# EAGLE design main (EAGLE 6.4)
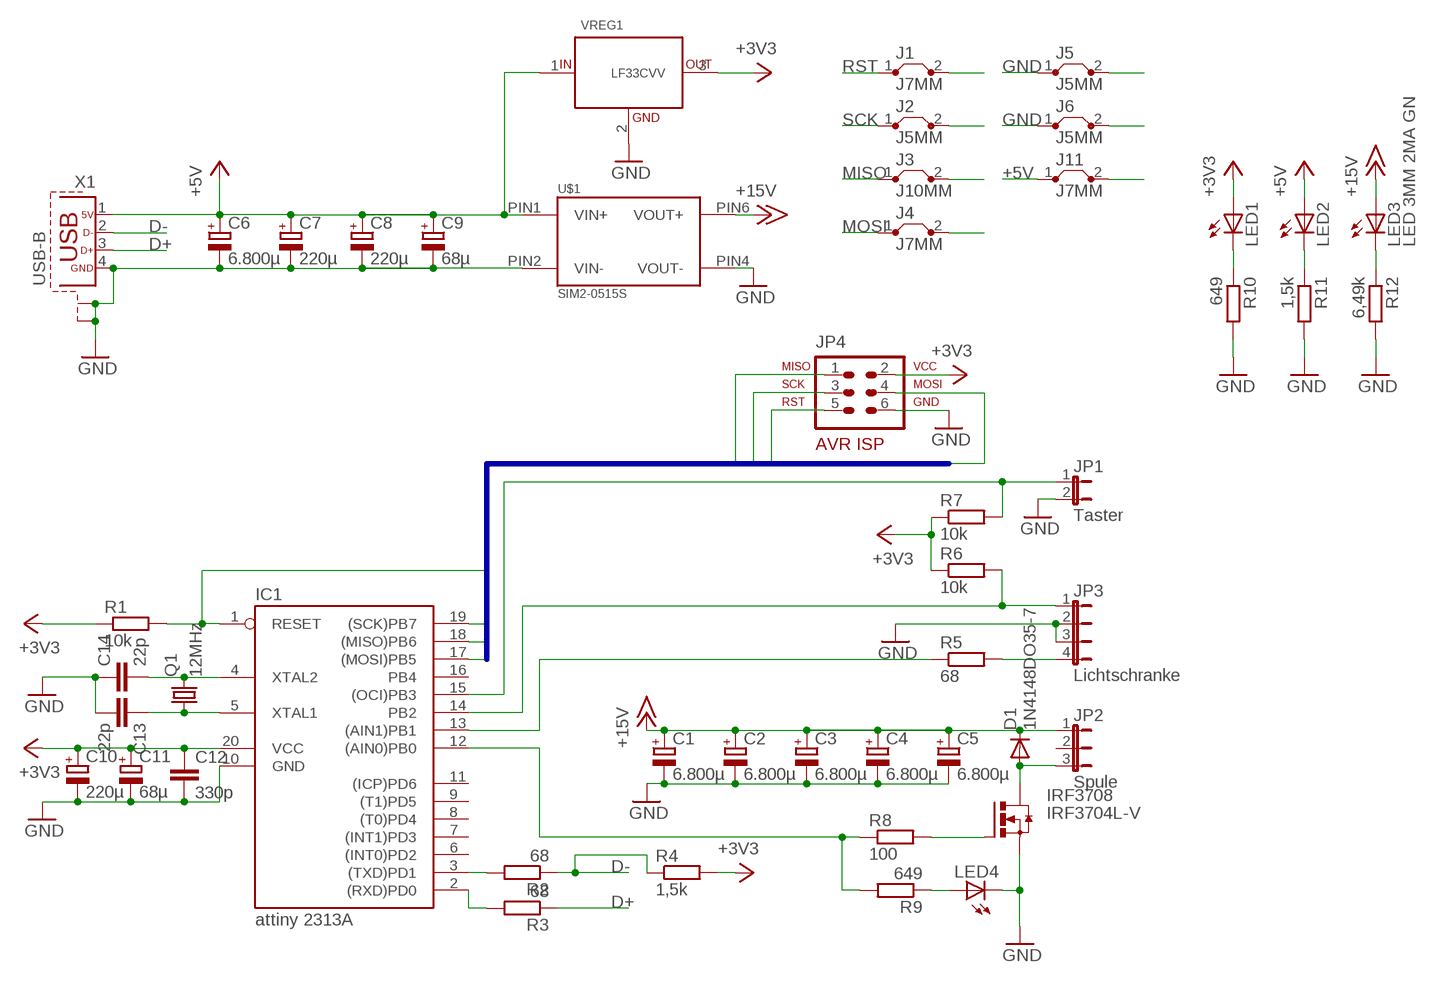
[diagram p0: schematic, sheet 1]

## Parts
C1  6.800µ  CPOL-EUE7.5-18  [E7,5-18]
C2  6.800µ  CPOL-EUE7.5-18  [E7,5-18]
C3  6.800µ  CPOL-EUE7.5-18  [E7,5-18]
C4  6.800µ  CPOL-EUE7.5-18  [E7,5-18]
C5  6.800µ  CPOL-EUE7.5-18  [E7,5-18]
C6  6.800µ  CPOL-EUE7.5-18  [E7,5-18]
C7  220µ  CPOL-EUE2.5-7  [E2,5-7]
C8  220µ  CPOL-EUE2.5-7  [E2,5-7]
C9  68µ  CPOL-EUE2.5-7  [E2,5-7]
C10  220µ  CPOL-EUE2.5-7  [E2,5-7]
C11  68µ  CPOL-EUE2.5-7  [E2,5-7]
C12  330p  C-EU050-024X044  [C050-024X044]
C13  22p  C-EU050-024X044  [C050-024X044]
C14  22p  C-EU050-024X044  [C050-024X044]
D1  1N4148DO35-7  [DO35-7]
IC1  attiny 2313A  AT90S2313P  [DIL20]
IRF3708  IRF3704L-V  [TO262-V]
J1  J7MM  [07]
J2  J5MM  [05]
J3  J10MM  [10]
J4  J7MM  [07]
J5  J5MM  [05]
J6  J5MM  [05]
J11  J7MM  [07]
JP1  Taster  JP1E  [JP1]
JP2  Spule  JP2E  [JP2]
JP3  Lichtschranke  JP4E  [JP4]
JP4  AVR-ISP-6VERT  [AVR-ISP-6]
LED1  LED3MM  [LED3MM]
LED2  LED3MM  [LED3MM]
LED3  LED 3MM 2MA GN  LED3MM  [LED3MM]
LED4  LED3MM  [LED3MM]
Q1  12MHz  CRYSTALHC18U-V  [HC18U-V]
R1  10k  R-EU_0207/10  [0207/10]
R2  68  R-EU_0207/10  [0207/10]
R3  68  R-EU_0207/10  [0207/10]
R4  1,5k  R-EU_0207/10  [0207/10]
R5  68  R-EU_0207/10  [0207/10]
R6  10k  R-EU_0207/10  [0207/10]
R7  10k  R-EU_0207/10  [0207/10]
R8  100  R-EU_0207/10  [0207/10]
R9  649  R-EU_0207/10  [0207/10]
R10  649  R-EU_0207/7  [0207/7]
R11  1,5k  R-EU_0207/7  [0207/7]
R12  6,49k  R-EU_0207/10  [0207/10]
U$1  SIM2-0515S  [SIL7]
VREG1  LF33CVV  [TO220V]
X1  USB-B  [USB-B]

## Nets
+3V3: C10.+ C11.+ C12.1 IC1.20(VCC) JP4.2 LED1.A R1.1 R4.2 R6.1 R7.1 VREG1.3(OUT)
+5V: C6.+ C7.+ C8.+ C9.+ J11.1 J11.2 LED2.A U$1.PIN1(VIN+) VREG1.1(IN) X1.1
+15V: C1.+ C2.+ C3.+ C4.+ C5.+ D1.C JP2.1 LED3.A U$1.PIN6(VOUT+)
D+: R3.1 X1.3
D-: R2.1 R4.1 X1.2
GND: C1.- C2.- C3.- C4.- C5.- C6.- C7.- C8.- C9.- C10.- C11.- C12.2 C13.2 C14.1 IC1.10(GND) IRF3708.3(S) J5.1 J5.2 J6.1 J6.2 JP1.2 JP3.2 JP3.3 JP4.6 LED4.K(C) R10.2 R11.2 R12.2 U$1.PIN2(VIN-) U$1.PIN4(VOUT-) VREG1.2(GND) X1.4 X1.S1 X1.S2
MISO: IC1.18((MISO)PB6) J3.1 J3.2 JP4.1
MOSI: IC1.17((MOSI)PB5) J4.1 J4.2 JP4.4
N$1: LED3.K(C) R12.1
N$2: IRF3708.1(G) R8.2
N$3: D1.A IRF3708.2(D) JP2.3
N$4: LED2.K(C) R11.1
N$5: LED1.K(C) R10.1
N$7: LED4.A R9.1
N$8: JP3.4 R5.2
N$11: C13.1 IC1.5(XTAL1) Q1.1
N$12: C14.2 IC1.4(XTAL2) Q1.2
N$13: IC1.15((OCI)PB3) JP1.1 R7.2
N$14: IC1.13((AIN1)PB1) R5.1
N$15: IC1.14(PB2) JP3.1 R6.2
N$18: IC1.2((RXD)PD0) R3.2
N$19: IC1.3((TXD)PD1) R2.2
PB0: IC1.12((AIN0)PB0) R8.1 R9.2
RST: IC1.1(RESET) J1.1 J1.2 JP4.5 R1.2
SCK: IC1.19((SCK)PB7) J2.1 J2.2 JP4.3
Unconnected: IC1.6((INT0)PD2) IC1.7((INT1)PD3) IC1.8((T0)PD4) IC1.9((T1)PD5) IC1.11((ICP)PD6) IC1.16(PB4) JP2.2

## Buses
MISO,MOSI,RST,SCK

## Library data of the parts
C1-C11 = resistor:CPOL-EU: POLARIZED CAPACITOR, European symbol
C12-C14 = rcl:C-EU: CAPACITOR, European symbol
D1 = diode:1N4148: DIODE high speed (Philips)
IC1 = atmel:AT90S2313: MICROCONTROLLER 2 Kbytes FLASH 128 bytes SRAM 128 bytes EEPROM UART; OC_FARNELL: unknown; OC_NEWARK: unknown
IRF3708 = transistor-power:IRF3704: SMPS MOSFET HEXFET® Power MOSFET Source: http://www.irf.com/product-info/datasheets/data/irf3704.pdf
J1-J6 J11 = jumper:J: Bridge
JP1 = jumper:JP1E: JUMPER
JP2 = jumper:JP2E: JUMPER
JP3 = jumper:JP4E: JUMPER
JP4 = avr-7:AVR-ISP-6: AVR ISP-6 Serial Programming Header
LED1-LED4 = led:LED: LED OSRAM: - CHIPLED LG R971, LG N971, LY N971, LG Q971, LY Q971, LO R971, LY R971 LH N974, LH R974 LS Q976, LO Q976, LY Q976 LO Q996 - Hyper CHIPLED LW Q18S LB Q993, LB Q99A, LB R99A - SideLED LS A670, LO A670, LY A670, LG A670, LP A670 LB A673, LV A673, LT A673, LW A673 LH A674 LY A675 LS A676, LA A676, LO A676, LY A676, LW A676 LS A679, LY A679, LG A679 - Hyper Micro SIDELED® LS Y876, LA Y876, LO Y876, LY Y876 LT Y87S - SmartLED LW L88C, LW L88S LB L89C, LB L89S, LG L890 LS L89K, LO L89K, LY L89K LS L896, LA L896, LO L896, LY L896 - TOPLED LS T670, LO T670, LY T670, LG T670, LP T670 LSG T670, LSP T670, LSY T670, LOP T670, LYG T670 LG T671, LOG T671, LSG T671 LB T673, LV T673, LT T673, LW T673 LH T674 LS T676, LA T676, LO T676, LY T676, LB T676, LH T676, LSB T676, LW T676 LB T67C, LV T67C, LT T67C, LS T67K, LO T67K, LY T67K, LW E67C LS E67B, LA E67B, LO E67B, LY E67B, LB E67C, LV E67C, LT E67C LW T67C LS T679, LY T679, LG T679 LS T770, LO T770, LY T770, LG T770, LP T770 LB T773, LV T773, LT T773, LW T773 LH T774 LS E675, LA E675, LY E675, LS T675 LS T776, LA T776, LO T776, LY T776, LB T776 LHGB T686 LT T68C, LB T68C - Hyper Mini TOPLED® LB M676 - Mini TOPLED Santana® LG M470 LS M47K, LO M47K, LY M47K Source: http://www.osram.convergy.de LUXEON: - LUMILED® LXK2-PW12-R00, LXK2-PW12-S00, LXK2-PW14-U00, LXK2-PW14-V00 LXK2-PM12-R00, LXK2-PM12-S00, LXK2-PM14-U00 LXK2-PE12-Q00, LXK2-PE12-R00, LXK2-PE12-S00, LXK2-PE14-T00, LXK2-PE14-U00 LXK2-PB12-K00, LXK2-PB12-L00, LXK2-PB12-M00, LXK2-PB14-N00, LXK2-PB14-P00, LXK2-PB14-Q00 LXK2-PR12-L00, LXK2-PR12-M00, LXK2-PR14-Q00, LXK2-PR14-R00 LXK2-PD12-Q00, LXK2-PD12-R00, LXK2-PD12-S00 LXK2-PH12-R00, LXK2-PH12-S00 LXK2-PL12-P00, LXK2-PL12-Q00, LXK2-PL12-R00 Source: www.luxeon.com KINGBRIGHT: KA-3528ASYC Source: www.kingbright.com
Q1 = crystal:CRYSTAL: CRYSTAL; OC_FARNELL: unknown; OC_NEWARK: unknown
R1-R12 = rcl:R-EU_: RESISTOR, European symbol
U$1 = eigene:SIM2-0515S
VREG1 = mp_vreg:LF33CV: LF33CV Low Drop 3.3V Voltage Regulator
X1 = mp_connect:USB-B: USB-B connector

## Board
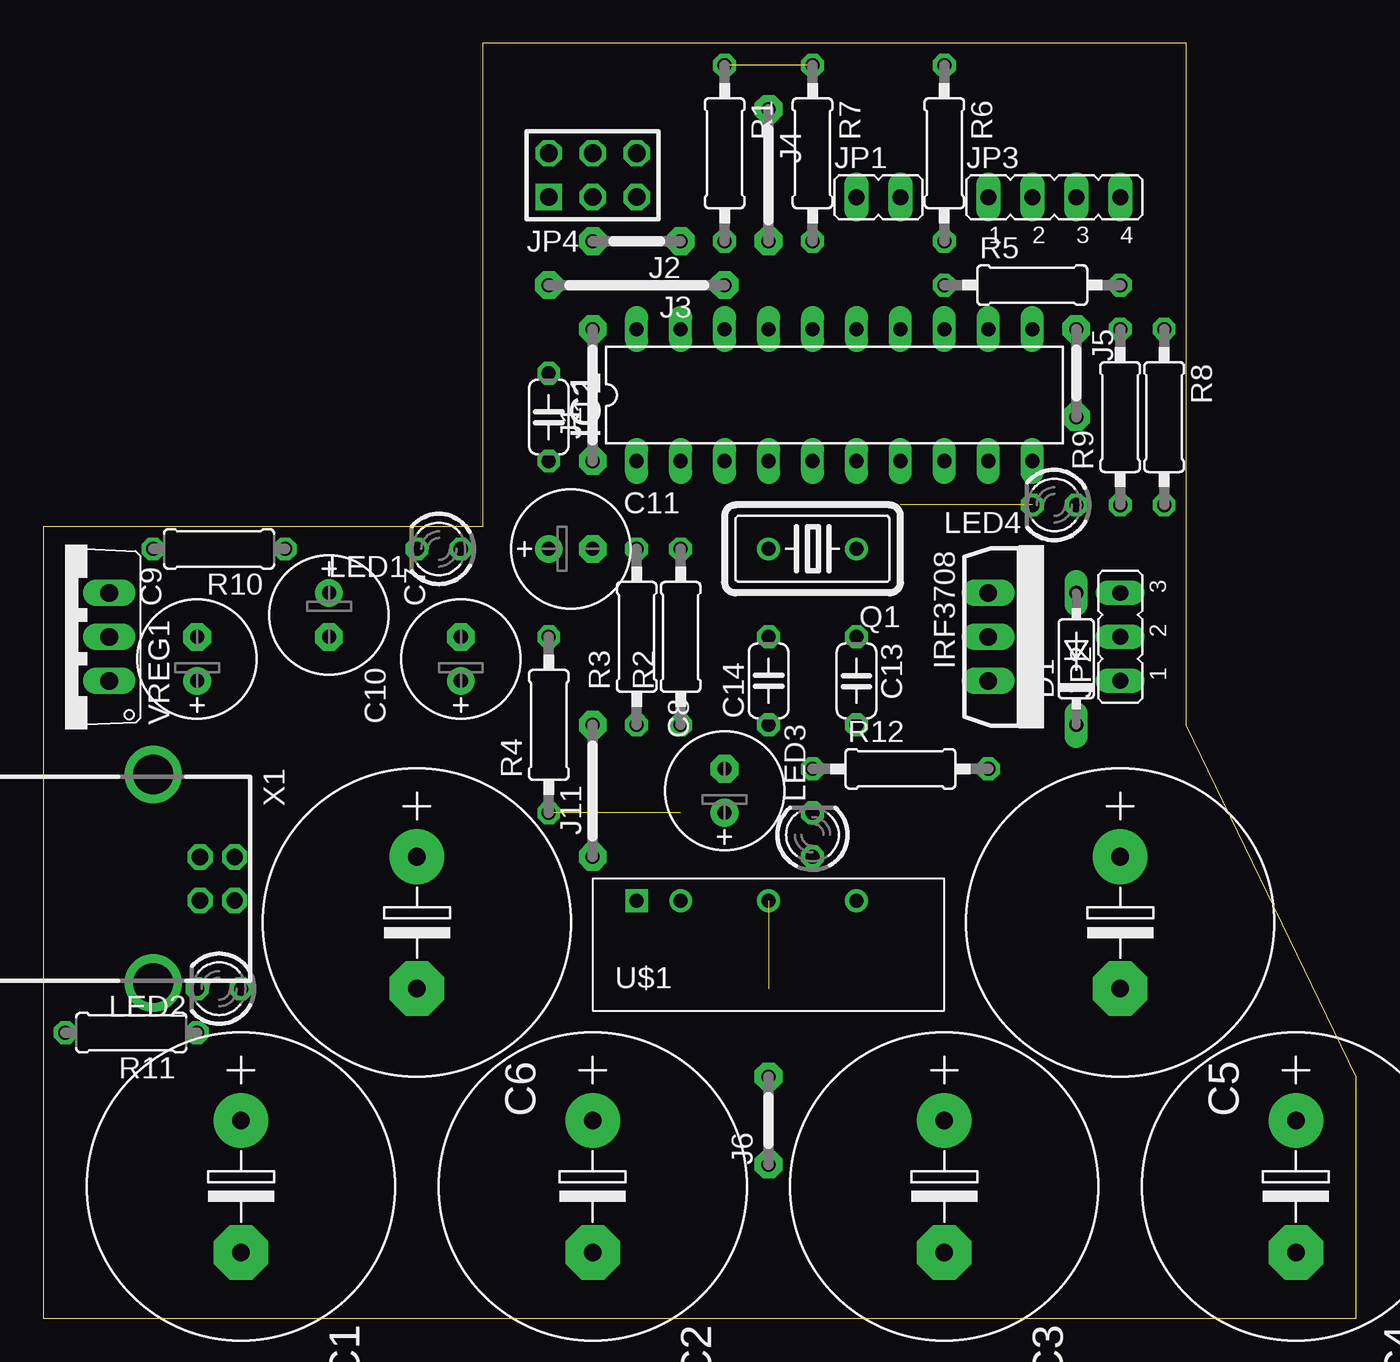
[diagram p1: board, top side]
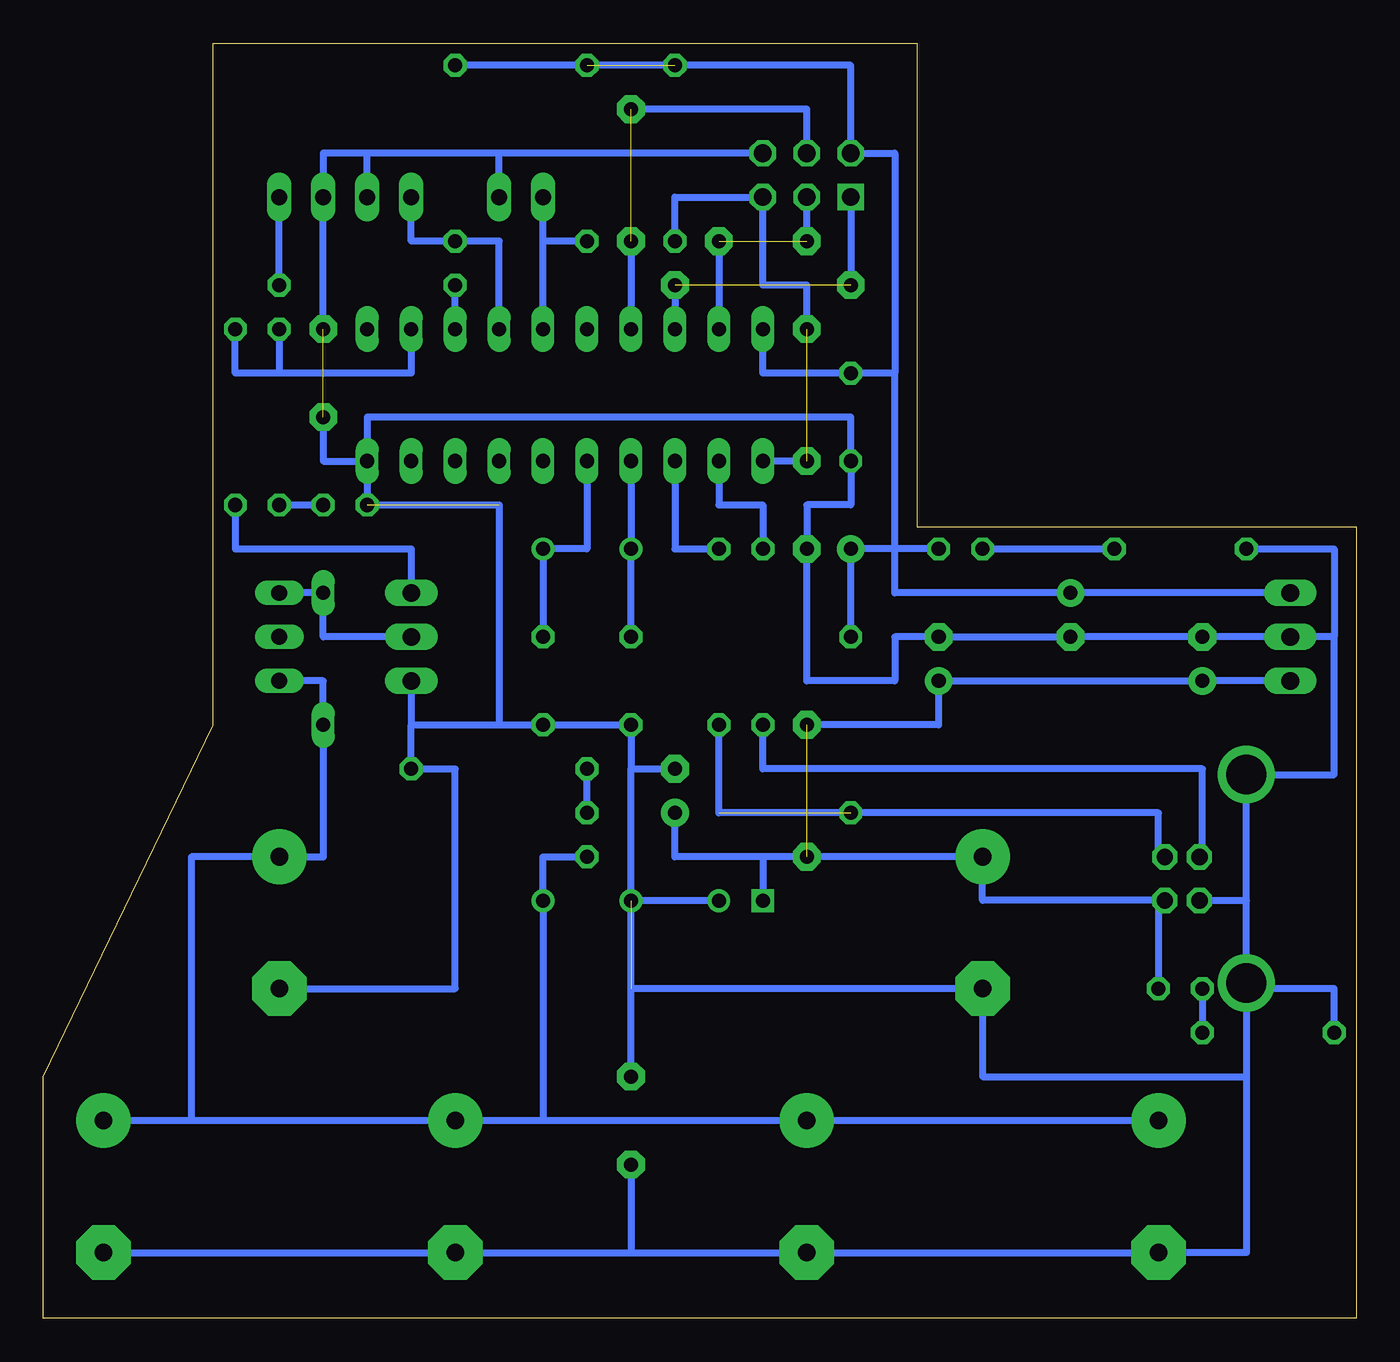
[diagram p2: board, bottom side, seen from below]

Size 75.87 x 73.66 mm. Coordinates in mm from the lower left corner, seen from the top.
Outline: 0,0 75.87,0 75.87,13.96 66.04,34.28 66.04,73.66 25.4,73.66 25.4,45.72 0,45.72 0,0
Copper layers (1*16): Top 0.035mm / dielectric 1.5mm / Bottom 0.035mm
Design rules "default": minimum track width 10mil, minimum drill 24mil, track to track 8mil, track to pad 8mil, pad to pad 8mil, via to via 8mil, smd to smd 8mil, copper to edge 40mil, drill to drill 8mil, minimum pad ring 10mil, minimum via ring 8mil, stop-mask expansion 4mil, vias tented up to drill 0mil, thermal gap 10mil

### Footprints (pad centres in the part's own frame; a part is rotated, then mirrored left to right if it is on the bottom)
E7,5-18 = drill 1.016 pad 3.15: + -3.81,0 | drill 1.016 pad 3.15 octagon: - 3.81,0
E2,5-7 = drill 0.813 pad 1.6: + -1.27,0 | drill 0.813 pad 1.6 octagon: - 1.27,0
C050-024X044 = drill 0.813 octagon: 1 -2.54,0; 2 2.54,0
DO35-7 = drill 0.813 long: A 3.81,0; C -3.81,0
DIL20 = drill 0.813 long: 1 -11.43,-3.81; 2 -8.89,-3.81; 3 -6.35,-3.81; 4 -3.81,-3.81; 5 -1.27,-3.81; 6 1.27,-3.81; 7 3.81,-3.81; 8 6.35,-3.81; 9 8.89,-3.81; 10 11.43,-3.81; 11 11.43,3.81; 12 8.89,3.81; 13 6.35,3.81; 14 3.81,3.81; 15 1.27,3.81; 16 -1.27,3.81; 17 -3.81,3.81; 18 -6.35,3.81; 19 -8.89,3.81; 20 -11.43,3.81
TO262-V = drill 1.016 long: 1 -2.54,0; 2 0,0; 3 2.54,0
07 = drill 0.813 pad 1.6 octagon: 1 -3.81,0; 2 3.81,0
05 = drill 0.813 pad 1.6 octagon: 1 -2.54,0; 2 2.54,0
10 = drill 0.813 pad 1.6 octagon: 1 -5.08,0; 2 5.08,0
JP1 = drill 0.914 long: 1 0,-1.27; 2 0,1.27
JP2 = drill 0.914 long: 1 -2.54,0; 2 0,0; 3 2.54,0
JP4 = drill 0.914 long: 1 -3.81,0; 2 -1.27,0; 3 1.27,0; 4 3.81,0
AVR-ISP-6 = drill 1.016 square: 1 -2.54,-1.27 | drill 1.016 octagon: 2 -2.54,1.27; 3 0,-1.27; 4 0,1.27; 5 2.54,-1.27; 6 2.54,1.27
LED3MM = drill 0.813 octagon: A -1.27,0; K 1.27,0
HC18U-V = drill 0.813: 1 -2.54,0; 2 2.54,0
0207/10 = drill 0.813 octagon: 1 -5.08,0; 2 5.08,0
0207/7 = drill 0.813 octagon: 1 -3.81,0; 2 3.81,0
SIL7 = drill 0.8 square: PIN1 0,0 | drill 0.8: PIN2 2.54,0; PIN4 7.62,0; PIN6 12.7,0
TO220V = drill 1.016 long: 1 -2.54,-2.54; 2 0,-2.54; 3 2.54,-2.54
USB-B = drill 0.95 octagon: 1 1.25,4.71; 2 -1.25,4.71; 3 -1.25,2.71; 4 1.25,2.71 | drill 2.3 pad 2.9: S1 -6.02,0; S2 6.02,0

### Placement (x,y rotation side)
C1  11.43,7.62 270 top
C2  31.75,7.62 270 top
C3  52.07,7.62 270 top
C4  72.39,7.62 270 top
C5  62.23,22.86 270 top
C6  21.59,22.86 270 top
C7  24.13,38.1 90 top
C8  39.37,30.48 90 top
C9  8.89,38.1 90 top
C10  16.51,40.64 270 top
C11  30.48,44.45 0 top
C12  29.21,52.07 270 top
C13  46.99,36.83 270 top
C14  41.91,36.83 90 top
D1  59.69,38.1 90 top
IC1  45.72,53.34 0 top
IRF3708  54.61,39.37 270 top
J1  31.75,53.34 90 top
J2  34.29,62.23 180 top
J3  34.29,59.69 180 top
J4  41.91,66.04 270 top
J5  59.69,54.61 270 top
J6  41.91,11.43 90 top
J11  31.75,30.48 90 top
JP1  48.26,64.77 270 top
JP2  62.23,39.37 90 top
JP3  58.42,64.77 0 top
JP4  31.75,66.04 0 top
LED1  22.86,44.45 180 top
LED2  10.16,19.05 180 top
LED3  44.45,27.94 90 top
LED4  58.42,46.99 180 top
Q1  44.45,44.45 180 top
R1  39.37,67.31 270 top
R2  36.83,39.37 90 top
R3  34.29,39.37 90 top
R4  29.21,34.29 90 top
R5  57.15,59.69 0 top
R6  52.07,67.31 270 top
R7  44.45,67.31 270 top
R8  64.77,52.07 270 top
R9  62.23,52.07 90 top
R10  10.16,44.45 180 top
R11  5.08,16.51 180 top
R12  49.53,31.75 0 top
U$1  34.29,24.13 0 top
VREG1  1.27,39.37 90 top
X1  6.35,25.4 270 top

### Tracks (layer width: path | path; a pad name or v marks a point on that pad's centre or on a via)
+3V3  (1 unrouted)
  Bottom 0.406: IC1.20 34.29,54.61 C12.1 26.67,54.61 | R6.1 R7.1 29.21,72.39 JP4.2 26.67,67.31 26.67,54.61 | 26.67,44.45 26.67,54.61 | VREG1.3 C10.+ 26.67,41.91 26.67,44.45 | 26.67,44.45 C11.+ R4.2 | LED1.A 26.67,44.45
+5V  (1 unrouted)
  Bottom 0.406: 34.29,26.67 J11.1 C6.+ 21.59,24.15 X1.1 11.43,24.15 LED2.A | 34.29,26.67 U$1.PIN1 | 34.29,26.67 39.37,26.67 C8.+ | J11.2 24.13,34.29 C7.+ C9.+ VREG1.1
+15V
  Bottom 0.406: C1.+ C2.+ 46.99,11.43 | 46.99,11.43 C3.+ 67.31,11.43 | 67.31,11.43 C4.+ | JP2.1 59.69,36.83 D1.C 59.69,26.67 C5.+ 67.31,26.67 67.31,11.43 | 46.99,11.43 U$1.PIN6 46.99,26.67 LED3.A
D+
  Bottom 0.406: X1.3 8.89,26.65 8.89,31.75 34.29,31.75 R3.1
D-  (1 unrouted)
  Bottom 0.406: X1.2 11.43,26.65 11.43,29.21 36.83,29.21 R2.1
GND  (3 unrouted)
  Bottom 0.406: 6.35,24.15 X1.S2 6.35,19.05 | 6.35,24.15 X1.S1 1.27,31.42 1.27,39.37 | 1.27,39.37 VREG1.2 C9.- C10.- C7.- 26.67,39.37 26.67,36.83 31.75,36.83 C11.- 31.75,46.99 29.21,46.99 C12.2 29.21,52.07 57.15,52.07 IC1.10 | IC1.10 59.69,49.53 J5.2 | IC1.10 LED4.K 49.53,46.99 49.53,34.29 | 49.53,34.29 C13.2 C14.1 41.91,31.75 | 6.35,19.05 6.35,13.97 | 6.35,13.97 6.35,3.81 C1.- C2.- 41.91,3.81 | IRF3708.3 54.61,34.29 | 54.61,34.29 49.53,34.29 | JP1.2 49.53,67.31 | 49.53,67.31 57.15,67.31 | 57.15,67.31 59.69,67.31 JP3.3 J5.1 | JP3.2 57.15,67.31 | C5.- 52.07,19.05 52.07,31.75 R12.2 54.61,34.29 | U$1.PIN2 U$1.PIN4 | JP4.6 49.53,67.31 | C4.- C3.- 41.91,3.81 | J6.1 41.91,3.81 | J6.2 41.91,19.05 | 41.91,19.05 41.91,31.75 | 41.91,31.75 C8.- | X1.4 6.35,24.15 | R11.2 1.27,19.05 6.35,19.05 | R10.2 1.27,44.45 1.27,39.37 | 6.35,13.97 21.59,13.97 C6.- 41.91,19.05
MISO  (1 unrouted)
  Bottom 0.406: JP4.1 J3.2 | J3.1 IC1.18
MOSI  (1 unrouted)
  Bottom 0.406: JP4.4 31.75,69.85 J4.1 | J4.2 IC1.17
N$1
  Bottom 0.406: LED3.K R12.1
N$2
  Bottom 0.406: R8.2 64.77,44.45 54.61,44.45 IRF3708.1
N$3
  Bottom 0.406: JP2.3 D1.A 59.69,39.37 IRF3708.2
N$4
  Bottom 0.406: LED2.K R11.1
N$5
  Bottom 0.406: LED1.K R10.1
N$7
  Bottom 0.406: R9.1 LED4.A
N$8
  Bottom 0.406: R5.2 JP3.4
N$11
  Bottom 0.406: IC1.5 44.45,44.45 Q1.1 C13.1
N$12
  Bottom 0.406: C14.2 Q1.2 IC1.4
N$13
  Bottom 0.406: IC1.15 46.99,62.23 | 46.99,62.23 JP1.1 | R7.2 46.99,62.23
N$14
  Bottom 0.406: IC1.13 R5.1
N$15
  Bottom 0.406: IC1.14 49.53,62.23 R6.2 54.61,62.23 JP3.1
N$18
  Bottom 0.406: IC1.2 36.83,46.99 34.29,46.99 R3.2
N$19
  Bottom 0.406: IC1.3 39.37,44.45 R2.2
PB0
  Bottom 0.406: IC1.12 54.61,54.61 62.23,54.61 | 62.23,54.61 64.77,54.61 R8.1 | R9.2 62.23,54.61
RST  (1 unrouted)
  Bottom 0.406: R1.2 39.37,64.77 JP4.5 34.29,59.69 31.75,59.69 J1.2 | J1.1 IC1.1
SCK  (1 unrouted)
  Bottom 0.406: J2.2 JP4.3 | J2.1 IC1.19